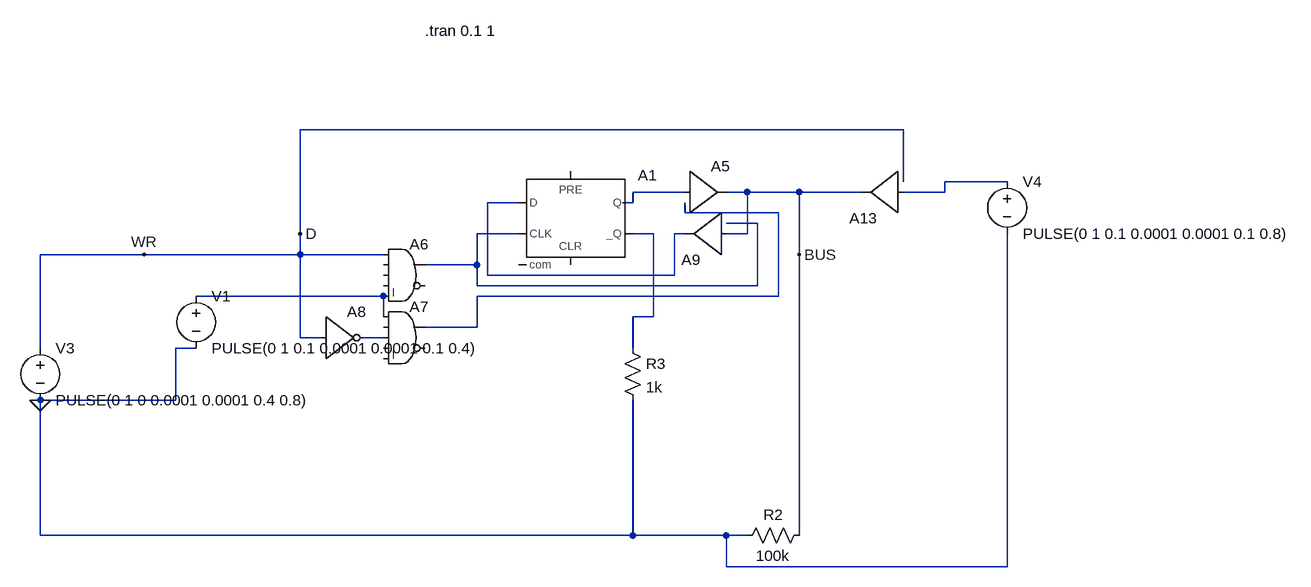
[diagram p0: schematic FlipFlopMemory.asc]
FlipFlopMemory.asc, the LTspice schematic file:
Version 4
SHEET 1 1864 1092
WIRE 1248 -768 320 -768
WIRE 1248 -688 1248 -768
WIRE 1408 -688 1312 -688
WIRE 912 -672 832 -672
WIRE 1008 -672 976 -672
WIRE 1088 -672 1008 -672
WIRE 1184 -672 1088 -672
WIRE 1312 -672 1312 -688
WIRE 1312 -672 1248 -672
WIRE 656 -656 608 -656
WIRE 832 -656 832 -672
WIRE 832 -656 816 -656
WIRE 912 -640 912 -656
WIRE 1056 -640 912 -640
WIRE 1024 -624 976 -624
WIRE 320 -608 320 -768
WIRE 656 -608 592 -608
WIRE 864 -608 832 -608
WIRE 912 -608 896 -608
WIRE 1008 -608 1008 -672
WIRE 1008 -608 976 -608
WIRE 80 -576 -80 -576
WIRE 320 -576 320 -608
WIRE 320 -576 80 -576
WIRE 448 -576 320 -576
WIRE 1088 -576 1088 -672
WIRE 592 -560 592 -608
WIRE 592 -560 512 -560
WIRE 608 -544 608 -656
WIRE 896 -544 896 -608
WIRE 896 -544 608 -544
WIRE 592 -528 592 -560
WIRE 1024 -528 1024 -624
WIRE 1024 -528 592 -528
WIRE 448 -512 160 -512
WIRE 1056 -512 1056 -640
WIRE 1056 -512 592 -512
WIRE 448 -480 448 -512
WIRE 864 -480 864 -608
WIRE 864 -480 832 -480
WIRE 592 -464 592 -512
WIRE 592 -464 512 -464
WIRE 320 -448 320 -576
WIRE 352 -448 320 -448
WIRE 448 -448 416 -448
WIRE -80 -432 -80 -576
WIRE 160 -432 128 -432
WIRE 832 -432 832 -480
WIRE 128 -352 128 -432
WIRE 128 -352 -80 -352
WIRE -80 -144 -80 -352
WIRE 832 -144 832 -352
WIRE 832 -144 -80 -144
WIRE 976 -144 832 -144
WIRE 1008 -144 976 -144
WIRE 1088 -144 1088 -576
WIRE 976 -96 976 -144
WIRE 1408 -96 1408 -608
WIRE 1408 -96 976 -96
FLAG 320 -608 D
FLAG 1088 -576 BUS
FLAG -80 -352 0
FLAG 80 -576 WR
SYMBOL Digital/dflop 736 -704 R0
SYMATTR InstName A1
SYMBOL res 992 -128 R270
WINDOW 0 32 56 VTop 2
WINDOW 3 0 56 VBottom 2
SYMATTR InstName R2
SYMATTR Value 100k
SYMBOL Digital/buf1 912 -736 R0
SYMATTR InstName A5
SYMBOL Digital/and 480 -608 R0
SYMATTR InstName A6
SYMBOL Digital/and 480 -512 R0
SYMATTR InstName A7
SYMBOL Digital/inv 352 -512 R0
SYMATTR InstName A8
SYMBOL Digital/buf1 976 -544 R180
SYMATTR InstName A9
SYMBOL voltage 160 -528 R0
SYMATTR InstName V1
SYMATTR Value PULSE(0 1 0.1 0.0001 0.0001 0.1 0.4)
SYMBOL voltage -80 -448 R0
SYMATTR InstName V3
SYMATTR Value PULSE(0 1 0 0.0001 0.0001 0.4 0.8)
SYMBOL Digital/buf1 1248 -608 R180
SYMATTR InstName A13
SYMBOL voltage 1408 -704 R0
SYMATTR InstName V4
SYMATTR Value PULSE(0 1 0.1 0.0001 0.0001 0.1 0.8)
SYMBOL res 816 -448 R0
SYMATTR InstName R3
SYMATTR Value 1k
TEXT 512 -920 Left 2 !.tran 0.1 1

The netlist it stands for:
* FlipFlopMemory.asc
A1 N003 0 N005 0 0 N006 N002 0 DFLOP
R2 0 BUS 100k
A5 N002 N004 N004 N004 N004 N004 BUS N004 BUF
A6 WR 0 0 0 N007 0 N005 0 AND
A7 N007 0 N008 0 0 0 N004 0 AND
A8 WR 0 0 0 0 N008 0 0 BUF
A9 BUS N005 N005 N005 N005 N005 N003 N005 BUF
V1 N007 0 PULSE(0 1 0.1 0.0001 0.0001 0.1 0.4)
V3 WR 0 PULSE(0 1 0 0.0001 0.0001 0.4 0.8)
A13 N001 WR WR WR WR WR BUS WR BUF
V4 N001 0 PULSE(0 1 0.1 0.0001 0.0001 0.1 0.8)
R3 N006 0 1k
.tran 0.1 1
.backanno
.end